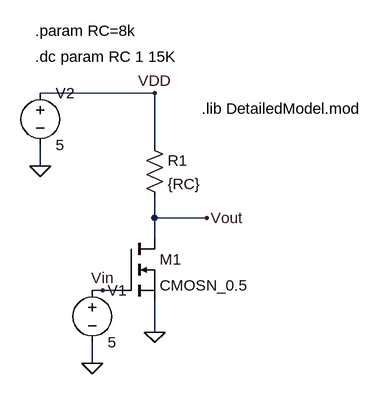
[diagram p0: schematic Question3HW3.asc]
Question3HW3.asc, the LTspice schematic file:
Version 4
SHEET 1 1668 680
WIRE 112 -336 -64 -336
WIRE 112 -256 112 -336
WIRE -64 -224 -64 -256
WIRE 112 -144 112 -176
WIRE 192 -144 112 -144
WIRE 112 -112 112 -144
WIRE 32 -32 16 -32
WIRE 64 -32 32 -32
WIRE 112 32 112 -16
WIRE 16 80 16 48
FLAG 112 -336 VDD
FLAG 112 32 0
FLAG 192 -144 Vout
FLAG 16 80 0
FLAG 32 -32 Vin
FLAG -64 -224 0
SYMBOL nmos 64 -112 R0
SYMATTR InstName M1
SYMATTR Value CMOSN_0.5
SYMBOL res 96 -272 R0
SYMATTR InstName R1
SYMATTR Value {RC}
SYMBOL voltage 16 -48 R0
SYMATTR InstName V1
SYMATTR Value 5
SYMBOL voltage -64 -352 R0
SYMATTR InstName V2
SYMATTR Value 5
TEXT -72 -432 Left 2 !.param RC=8k
TEXT -72 -392 Left 2 !.dc param RC 1 15K
TEXT 184 -312 Left 2 !.lib DetailedModel.mod

The netlist it stands for:
* Question3HW3.asc
M1 Vout Vin 0 0 CMOSN_0.5
R1 VDD Vout {RC}
V1 Vin 0 5
V2 VDD 0 5
.model NMOS NMOS
.model PMOS PMOS
.lib standard.mos
.param RC=8k
.dc param RC 1 15K
.lib DetailedModel.mod
.backanno
.end